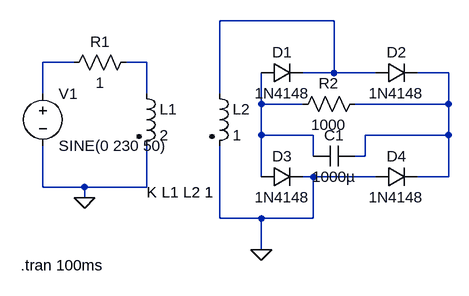
[diagram p0: schematic Bridge rectifier with filter.asc]
Bridge rectifier with filter.asc, the LTspice schematic file:
Version 4
SHEET 1 880 680
WIRE 416 16 240 16
WIRE 16 80 -32 80
WIRE 128 80 96 80
WIRE 416 96 416 16
WIRE 416 96 368 96
WIRE 480 96 416 96
WIRE 592 96 544 96
WIRE -32 128 -32 80
WIRE 128 128 128 80
WIRE 240 128 240 16
WIRE 304 144 304 96
WIRE 368 144 304 144
WIRE 592 144 592 96
WIRE 592 144 448 144
WIRE 304 192 304 144
WIRE 384 192 304 192
WIRE 592 192 592 144
WIRE 592 192 464 192
WIRE 384 224 384 192
WIRE 464 224 464 192
WIRE 464 224 448 224
WIRE 304 256 304 192
WIRE 384 256 368 256
WIRE 480 256 384 256
WIRE 592 256 592 192
WIRE 592 256 544 256
WIRE -32 272 -32 208
WIRE 32 272 -32 272
WIRE 128 272 128 208
WIRE 128 272 32 272
WIRE 32 288 32 272
WIRE 240 320 240 208
WIRE 304 320 240 320
WIRE 384 320 384 256
WIRE 384 320 304 320
WIRE 304 368 304 320
FLAG 32 288 0
FLAG 304 368 0
SYMBOL voltage -32 112 R0
WINDOW 123 0 0 Left 0
WINDOW 39 0 0 Left 0
SYMATTR InstName V1
SYMATTR Value SINE(0 230 50)
SYMBOL ind2 112 112 R0
SYMATTR InstName L1
SYMATTR Value 2
SYMATTR Type ind
SYMBOL res 112 64 R90
WINDOW 0 0 56 VBottom 2
WINDOW 3 32 56 VTop 2
SYMATTR InstName R1
SYMATTR Value 1
SYMBOL ind2 224 112 R0
SYMATTR InstName L2
SYMATTR Value 1
SYMATTR Type ind
SYMBOL diode 304 112 R270
WINDOW 0 32 32 VTop 2
WINDOW 3 0 32 VBottom 2
SYMATTR InstName D1
SYMATTR Value 1N4148
SYMBOL diode 480 112 R270
WINDOW 0 32 32 VTop 2
WINDOW 3 0 32 VBottom 2
SYMATTR InstName D2
SYMATTR Value 1N4148
SYMBOL diode 304 272 R270
WINDOW 0 32 32 VTop 2
WINDOW 3 0 32 VBottom 2
SYMATTR InstName D3
SYMATTR Value 1N4148
SYMBOL diode 480 272 R270
WINDOW 0 32 32 VTop 2
WINDOW 3 0 32 VBottom 2
SYMATTR InstName D4
SYMATTR Value 1N4148
SYMBOL res 464 128 R90
WINDOW 0 0 56 VBottom 2
WINDOW 3 32 56 VTop 2
SYMATTR InstName R2
SYMATTR Value 1000
SYMBOL cap 448 208 R90
WINDOW 0 0 32 VBottom 2
WINDOW 3 32 32 VTop 2
SYMATTR InstName C1
SYMATTR Value 1000µ
TEXT 128 280 Left 2 !K L1 L2 1
TEXT -66 392 Left 2 !.tran 100ms

The netlist it stands for:
* Bridge rectifier with filter.asc
V1 N002 0 SINE(0 230 50)
L1 N003 0 2
R1 N003 N002 1
L2 N001 0 1
D1 N005 N001 1N4148
D2 N001 N004 1N4148
D3 N005 0 1N4148
D4 0 N004 1N4148
R2 N004 N005 1000
C1 N004 N005 1000µ
.model D D
.lib standard.dio
K L1 L2 1
.tran 100ms
.backanno
.end